# EAGLE schematic Keyboard (EAGLE 9.2.0)
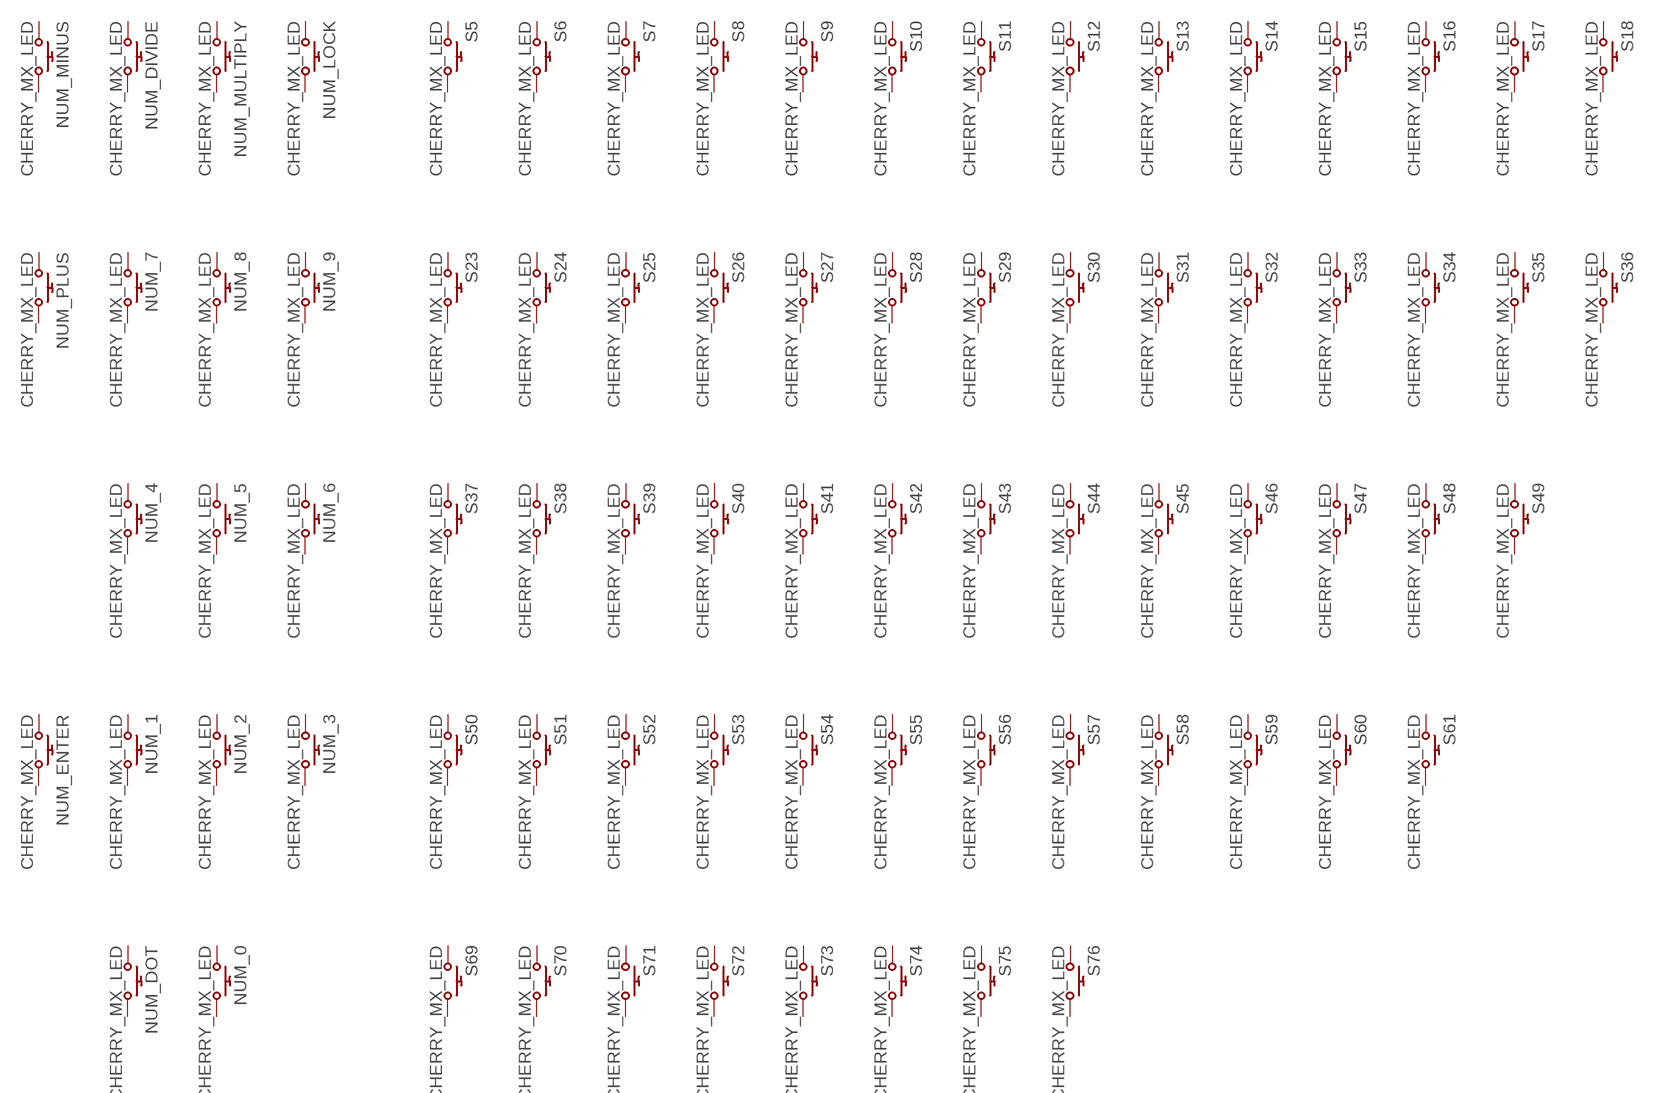
[diagram p0: schematic, sheet 1]

## Parts
NUM_0  CHERRY_MX_LED  [CHERRY_MX_LED]
NUM_1  CHERRY_MX_LED  [CHERRY_MX_LED]
NUM_2  CHERRY_MX_LED  [CHERRY_MX_LED]
NUM_3  CHERRY_MX_LED  [CHERRY_MX_LED]
NUM_4  CHERRY_MX_LED  [CHERRY_MX_LED]
NUM_5  CHERRY_MX_LED  [CHERRY_MX_LED]
NUM_6  CHERRY_MX_LED  [CHERRY_MX_LED]
NUM_7  CHERRY_MX_LED  [CHERRY_MX_LED]
NUM_8  CHERRY_MX_LED  [CHERRY_MX_LED]
NUM_9  CHERRY_MX_LED  [CHERRY_MX_LED]
NUM_DIVIDE  CHERRY_MX_LED  [CHERRY_MX_LED]
NUM_DOT  CHERRY_MX_LED  [CHERRY_MX_LED]
NUM_ENTER  CHERRY_MX_LED  [CHERRY_MX_LED]
NUM_LOCK  CHERRY_MX_LED  [CHERRY_MX_LED]
NUM_MINUS  CHERRY_MX_LED  [CHERRY_MX_LED]
NUM_MULTIPLY  CHERRY_MX_LED  [CHERRY_MX_LED]
NUM_PLUS  CHERRY_MX_LED  [CHERRY_MX_LED]
S5  CHERRY_MX_LED  [CHERRY_MX_LED]
S6  CHERRY_MX_LED  [CHERRY_MX_LED]
S7  CHERRY_MX_LED  [CHERRY_MX_LED]
S8  CHERRY_MX_LED  [CHERRY_MX_LED]
S9  CHERRY_MX_LED  [CHERRY_MX_LED]
S10  CHERRY_MX_LED  [CHERRY_MX_LED]
S11  CHERRY_MX_LED  [CHERRY_MX_LED]
S12  CHERRY_MX_LED  [CHERRY_MX_LED]
S13  CHERRY_MX_LED  [CHERRY_MX_LED]
S14  CHERRY_MX_LED  [CHERRY_MX_LED]
S15  CHERRY_MX_LED  [CHERRY_MX_LED]
S16  CHERRY_MX_LED  [CHERRY_MX_LED]
S17  CHERRY_MX_LED  [CHERRY_MX_LED]
S18  CHERRY_MX_LED  [CHERRY_MX_LED]
S23  CHERRY_MX_LED  [CHERRY_MX_LED]
S24  CHERRY_MX_LED  [CHERRY_MX_LED]
S25  CHERRY_MX_LED  [CHERRY_MX_LED]
S26  CHERRY_MX_LED  [CHERRY_MX_LED]
S27  CHERRY_MX_LED  [CHERRY_MX_LED]
S28  CHERRY_MX_LED  [CHERRY_MX_LED]
S29  CHERRY_MX_LED  [CHERRY_MX_LED]
S30  CHERRY_MX_LED  [CHERRY_MX_LED]
S31  CHERRY_MX_LED  [CHERRY_MX_LED]
S32  CHERRY_MX_LED  [CHERRY_MX_LED]
S33  CHERRY_MX_LED  [CHERRY_MX_LED]
S34  CHERRY_MX_LED  [CHERRY_MX_LED]
S35  CHERRY_MX_LED  [CHERRY_MX_LED]
S36  CHERRY_MX_LED  [CHERRY_MX_LED]
S37  CHERRY_MX_LED  [CHERRY_MX_LED]
S38  CHERRY_MX_LED  [CHERRY_MX_LED]
S39  CHERRY_MX_LED  [CHERRY_MX_LED]
S40  CHERRY_MX_LED  [CHERRY_MX_LED]
S41  CHERRY_MX_LED  [CHERRY_MX_LED]
S42  CHERRY_MX_LED  [CHERRY_MX_LED]
S43  CHERRY_MX_LED  [CHERRY_MX_LED]
S44  CHERRY_MX_LED  [CHERRY_MX_LED]
S45  CHERRY_MX_LED  [CHERRY_MX_LED]
S46  CHERRY_MX_LED  [CHERRY_MX_LED]
S47  CHERRY_MX_LED  [CHERRY_MX_LED]
S48  CHERRY_MX_LED  [CHERRY_MX_LED]
S49  CHERRY_MX_LED  [CHERRY_MX_LED]
S50  CHERRY_MX_LED  [CHERRY_MX_LED]
S51  CHERRY_MX_LED  [CHERRY_MX_LED]
S52  CHERRY_MX_LED  [CHERRY_MX_LED]
S53  CHERRY_MX_LED  [CHERRY_MX_LED]
S54  CHERRY_MX_LED  [CHERRY_MX_LED]
S55  CHERRY_MX_LED  [CHERRY_MX_LED]
S56  CHERRY_MX_LED  [CHERRY_MX_LED]
S57  CHERRY_MX_LED  [CHERRY_MX_LED]
S58  CHERRY_MX_LED  [CHERRY_MX_LED]
S59  CHERRY_MX_LED  [CHERRY_MX_LED]
S60  CHERRY_MX_LED  [CHERRY_MX_LED]
S61  CHERRY_MX_LED  [CHERRY_MX_LED]
S69  CHERRY_MX_LED  [CHERRY_MX_LED]
S70  CHERRY_MX_LED  [CHERRY_MX_LED]
S71  CHERRY_MX_LED  [CHERRY_MX_LED]
S72  CHERRY_MX_LED  [CHERRY_MX_LED]
S73  CHERRY_MX_LED  [CHERRY_MX_LED]
S74  CHERRY_MX_LED  [CHERRY_MX_LED]
S75  CHERRY_MX_LED  [CHERRY_MX_LED]
S76  CHERRY_MX_LED  [CHERRY_MX_LED]
Unconnected: NUM_0.L1(A) NUM_0.L2(C) NUM_0.S1 NUM_0.S2 NUM_1.L1(A) NUM_1.L2(C) NUM_1.S1 NUM_1.S2 NUM_2.L1(A) NUM_2.L2(C) NUM_2.S1 NUM_2.S2 NUM_3.L1(A) NUM_3.L2(C) NUM_3.S1 NUM_3.S2 NUM_4.L1(A) NUM_4.L2(C) NUM_4.S1 NUM_4.S2 NUM_5.L1(A) NUM_5.L2(C) NUM_5.S1 NUM_5.S2 NUM_6.L1(A) NUM_6.L2(C) NUM_6.S1 NUM_6.S2 NUM_7.L1(A) NUM_7.L2(C) NUM_7.S1 NUM_7.S2 NUM_8.L1(A) NUM_8.L2(C) NUM_8.S1 NUM_8.S2 NUM_9.L1(A) NUM_9.L2(C) NUM_9.S1 NUM_9.S2 NUM_DIVIDE.L1(A) NUM_DIVIDE.L2(C) NUM_DIVIDE.S1 NUM_DIVIDE.S2 NUM_DOT.L1(A) NUM_DOT.L2(C) NUM_DOT.S1 NUM_DOT.S2 NUM_ENTER.L1(A) NUM_ENTER.L2(C) NUM_ENTER.S1 NUM_ENTER.S2 NUM_LOCK.L1(A) NUM_LOCK.L2(C) NUM_LOCK.S1 NUM_LOCK.S2 NUM_MINUS.L1(A) NUM_MINUS.L2(C) NUM_MINUS.S1 NUM_MINUS.S2 NUM_MULTIPLY.L1(A) NUM_MULTIPLY.L2(C) NUM_MULTIPLY.S1 NUM_MULTIPLY.S2 NUM_PLUS.L1(A) NUM_PLUS.L2(C) NUM_PLUS.S1 NUM_PLUS.S2 S5.L1(A) S5.L2(C) S5.S1 S5.S2 S6.L1(A) S6.L2(C) S6.S1 S6.S2 S7.L1(A) S7.L2(C) S7.S1 S7.S2 S8.L1(A) S8.L2(C) S8.S1 S8.S2 S9.L1(A) S9.L2(C) S9.S1 S9.S2 S10.L1(A) S10.L2(C) S10.S1 S10.S2 S11.L1(A) S11.L2(C) S11.S1 S11.S2 S12.L1(A) S12.L2(C) S12.S1 S12.S2 S13.L1(A) S13.L2(C) S13.S1 S13.S2 S14.L1(A) S14.L2(C) S14.S1 S14.S2 S15.L1(A) S15.L2(C) S15.S1 S15.S2 S16.L1(A) S16.L2(C) S16.S1 S16.S2 S17.L1(A) S17.L2(C) S17.S1 S17.S2 S18.L1(A) S18.L2(C) S18.S1 S18.S2 S23.L1(A) S23.L2(C) S23.S1 S23.S2 S24.L1(A) S24.L2(C) S24.S1 S24.S2 S25.L1(A) S25.L2(C) S25.S1 S25.S2 S26.L1(A) S26.L2(C) S26.S1 S26.S2 S27.L1(A) S27.L2(C) S27.S1 S27.S2 S28.L1(A) S28.L2(C) S28.S1 S28.S2 S29.L1(A) S29.L2(C) S29.S1 S29.S2 S30.L1(A) S30.L2(C) S30.S1 S30.S2 S31.L1(A) S31.L2(C) S31.S1 S31.S2 S32.L1(A) S32.L2(C) S32.S1 S32.S2 S33.L1(A) S33.L2(C) S33.S1 S33.S2 S34.L1(A) S34.L2(C) S34.S1 S34.S2 S35.L1(A) S35.L2(C) S35.S1 S35.S2 S36.L1(A) S36.L2(C) S36.S1 S36.S2 S37.L1(A) S37.L2(C) S37.S1 S37.S2 S38.L1(A) S38.L2(C) S38.S1 S38.S2 S39.L1(A) S39.L2(C) S39.S1 S39.S2 S40.L1(A) S40.L2(C) S40.S1 S40.S2 S41.L1(A) S41.L2(C) S41.S1 S41.S2 S42.L1(A) S42.L2(C) S42.S1 S42.S2 S43.L1(A) S43.L2(C) S43.S1 S43.S2 S44.L1(A) S44.L2(C) S44.S1 S44.S2 S45.L1(A) S45.L2(C) S45.S1 S45.S2 S46.L1(A) S46.L2(C) S46.S1 S46.S2 S47.L1(A) S47.L2(C) S47.S1 S47.S2 S48.L1(A) S48.L2(C) S48.S1 S48.S2 S49.L1(A) S49.L2(C) S49.S1 S49.S2 S50.L1(A) S50.L2(C) S50.S1 S50.S2 S51.L1(A) S51.L2(C) S51.S1 S51.S2 S52.L1(A) S52.L2(C) S52.S1 S52.S2 S53.L1(A) S53.L2(C) S53.S1 S53.S2 S54.L1(A) S54.L2(C) S54.S1 S54.S2 S55.L1(A) S55.L2(C) S55.S1 S55.S2 S56.L1(A) S56.L2(C) S56.S1 S56.S2 S57.L1(A) S57.L2(C) S57.S1 S57.S2 S58.L1(A) S58.L2(C) S58.S1 S58.S2 S59.L1(A) S59.L2(C) S59.S1 S59.S2 S60.L1(A) S60.L2(C) S60.S1 S60.S2 S61.L1(A) S61.L2(C) S61.S1 S61.S2 S69.L1(A) S69.L2(C) S69.S1 S69.S2 S70.L1(A) S70.L2(C) S70.S1 S70.S2 S71.L1(A) S71.L2(C) S71.S1 S71.S2 S72.L1(A) S72.L2(C) S72.S1 S72.S2 S73.L1(A) S73.L2(C) S73.S1 S73.S2 S74.L1(A) S74.L2(C) S74.S1 S74.S2 S75.L1(A) S75.L2(C) S75.S1 S75.S2 S76.L1(A) S76.L2(C) S76.S1 S76.S2

## Library data of the parts
NUM_0 NUM_1-NUM_9 NUM_DIVIDE NUM_DOT NUM_ENTER NUM_LOCK NUM_MINUS NUM_MULTIPLY NUM_PLUS S5-S18 S23-S61 S69-S76 = cherry:CHERRY_MX_LED: Cherry MX with LED; FARNELL: 2292961; MOUSER: 540_MX1A_11NW